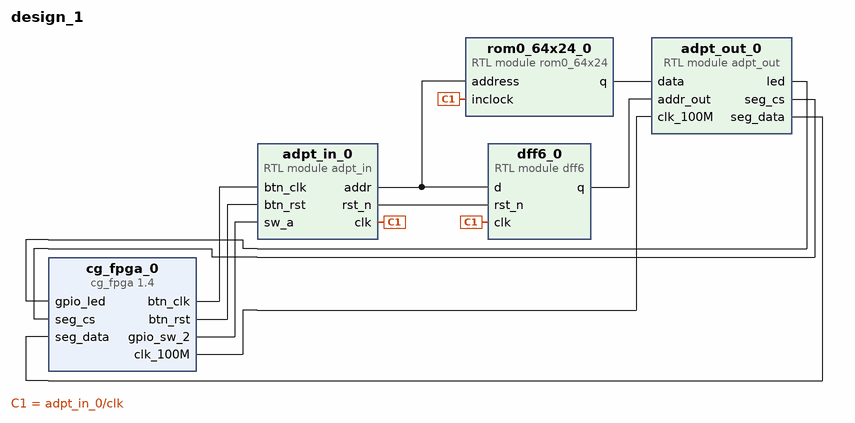
[diagram p0: block diagram of the top level]
# Vivado block design design_1, xc7z020clg400-1, Vivado 2024.2
create_bd_design design_1

create_bd_cell -type ip -vlnv educg.net:user:cg_fpga:1.4 cg_fpga_0
create_bd_cell -type module -reference adpt_in adpt_in_0
create_bd_cell -type module -reference dff6 dff6_0
create_bd_cell -type module -reference adpt_out adpt_out_0
create_bd_cell -type module -reference rom0_64x24 rom0_64x24_0

# ---- connections ----

connect_bd_net [get_bd_pins adpt_in_0/addr] [get_bd_pins dff6_0/d] [get_bd_pins rom0_64x24_0/address]
connect_bd_net [get_bd_pins adpt_in_0/clk] [get_bd_pins dff6_0/clk] [get_bd_pins rom0_64x24_0/inclock]
connect_bd_net [get_bd_pins adpt_in_0/rst_n] [get_bd_pins dff6_0/rst_n]
connect_bd_net [get_bd_pins adpt_out_0/led] [get_bd_pins cg_fpga_0/gpio_led]
connect_bd_net [get_bd_pins adpt_out_0/seg_cs] [get_bd_pins cg_fpga_0/seg_cs]
connect_bd_net [get_bd_pins adpt_out_0/seg_data] [get_bd_pins cg_fpga_0/seg_data]
connect_bd_net [get_bd_pins cg_fpga_0/btn_clk] [get_bd_pins adpt_in_0/btn_clk]
connect_bd_net [get_bd_pins cg_fpga_0/btn_rst] [get_bd_pins adpt_in_0/btn_rst]
connect_bd_net [get_bd_pins cg_fpga_0/clk_100M] [get_bd_pins adpt_out_0/clk_100M]
connect_bd_net [get_bd_pins cg_fpga_0/gpio_sw_2] [get_bd_pins adpt_in_0/sw_a]
connect_bd_net [get_bd_pins dff6_0/q] [get_bd_pins adpt_out_0/addr_out]
connect_bd_net [get_bd_pins rom0_64x24_0/q] [get_bd_pins adpt_out_0/data]

validate_bd_design
save_bd_design
